# Altium schematic sheet RF.SchDoc
size A4
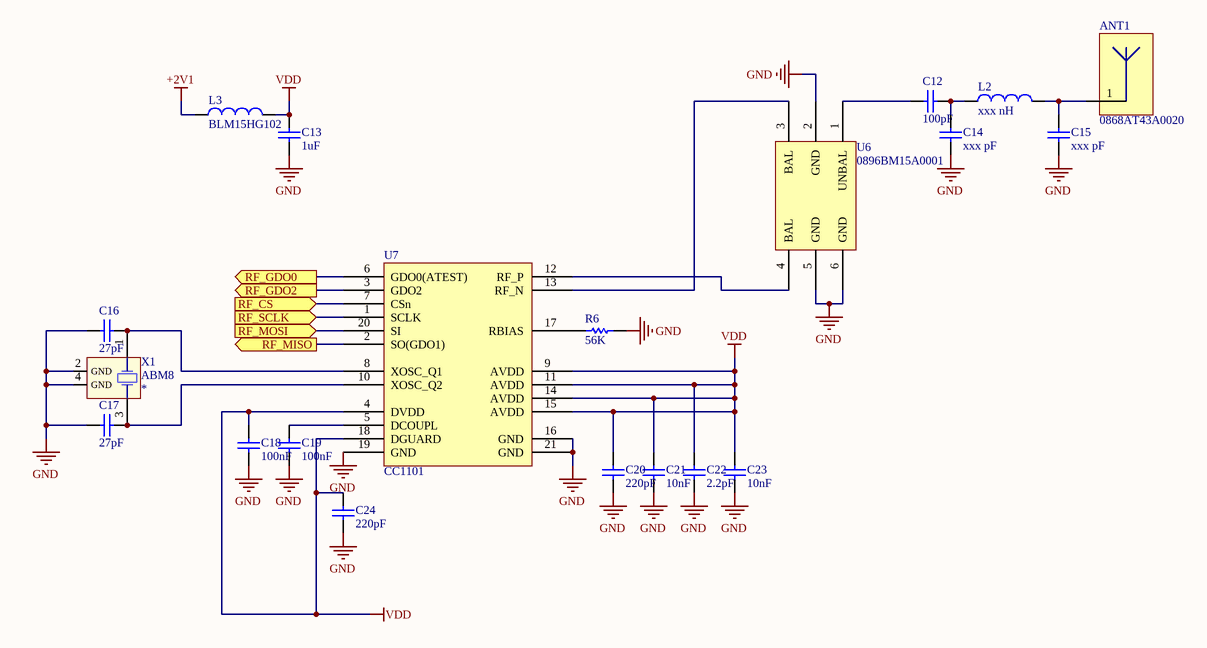
[diagram p0: RF.SchDoc]

## Parts
ANT1  0868AT43A0020  [0868AT43A0020]
C12  value 100pF  [0402_ipc]  (hidden comment: Cap)
C13  value 1uF  [0402_ipc]  (hidden comment: Cap)
C14  value xxx pF  [0402_ipc]  (hidden comment: Cap)
C15  value xxx pF  [0402_ipc]  (hidden comment: Cap)
C16  value 27pF  [0402_ipc]  (hidden comment: Cap)
C17  value 27pF  [0402_ipc]  (hidden comment: Cap)
C18  value 100nF  [0402_ipc]  (hidden comment: Cap)
C19  value 100nF  [0402_ipc]  (hidden comment: Cap)
C20  value 220pF  [0402_ipc]  (hidden comment: Cap)
C21  value 10nF  [0402_ipc]  (hidden comment: Cap)
C22  value 2.2pF  [0402_ipc]  (hidden comment: Cap)
C23  value 10nF  [0402_ipc]  (hidden comment: Cap)
C24  value 220pF  [0402_ipc]  (hidden comment: Cap)
L2  value xxx nH  [0402_ipc]  (hidden comment: Inductor)
L3  value BLM15HG102  [0603_ipc]  (hidden comment: Inductor)
R6  value 56K  [0402_ipc]  (hidden comment: Res)
U6  0896BM15A0001  [0896BM15A0001]
U7  CC1101  [CC1101_QFN]
X1  ABM8  [ABM8]

## Ports
RF_CS (in), RF_GDO0 (out), RF_GDO2 (out), RF_MISO (out), RF_MOSI (in), RF_SCLK (in)

## Nets
+2V1: L3.1
GND: C13.1 C14.2 C15.2 C16.2 C17.2 C18.2 C19.2 C20.1 C21.1 C22.1 C23.1 C24.1 R6.2 U6.2(GND) U6.5(GND) U6.6(GND) U7.16(GND) U7.19(GND) U7.21(GND) X1.2(GND) X1.4(GND)
VDD: C13.2 C18.1 C20.2 C21.2 C22.2 C23.2 C24.2 L3.2 U7.4(DVDD) U7.9(AVDD) U7.11(AVDD) U7.14(AVDD) U7.15(AVDD) U7.18(DGUARD)
RF_CS: U7.7(CSn) ; port RF_CS
RF_GDO0: U7.6(GDO0(ATEST)) ; port RF_GDO0
RF_GDO2: U7.3(GDO2) ; port RF_GDO2
RF_MISO: U7.2(SO(GDO1)) ; port RF_MISO
RF_MOSI: U7.20(SI) ; port RF_MOSI
RF_SCLK: U7.1(SCLK) ; port RF_SCLK
NetANT1_1: ANT1.1(RF) C15.1 L2.2
NetC12_1: C12.1 C14.1 L2.1
NetC12_2: C12.2 U6.1(UNBAL)
NetC16_1: C16.1 U7.8(XOSC_Q1) X1.1(OSC1)
NetC17_1: C17.1 U7.10(XOSC_Q2) X1.3(OSC2)
NetC19_1: C19.1 U7.5(DCOUPL)
NetR6_1: R6.1 U7.17(RBIAS)
NetU6_3: U6.3(BAL) U7.13(RF_N)
NetU6_4: U6.4(BAL) U7.12(RF_P)

## Library data of the parts
ANT1 = 0868AT43A0020: 868 MHz Chip Ceramic Antenna; PartNumber: 0868AT43A0020E; Farnell: 1885493
C12 = Cap: Capacitor; PartNumber: GRM1555C1H101JA01D; PackageReference: RAD-0.3; Publisher: Altium Limited; Farnell: 2218836
C13 = Cap: Capacitor; PartNumber: GRM155R61C105KA12D; PackageReference: RAD-0.3; Publisher: Altium Limited; Farnell: 2362093
C14 C15 = Cap: Capacitor; PackageReference: RAD-0.3; Publisher: Altium Limited
C16 C17 = Cap: Capacitor; PartNumber: GRM1555C1H270JA01D; PackageReference: RAD-0.3; Publisher: Altium Limited; Farnell: 1828877
C18 C19 = Cap: Capacitor; PartNumber: GRM155R71C104KA88D; PackageReference: RAD-0.3; Publisher: Altium Limited; Farnell: 8819742
C20 C24 = Cap: Capacitor; PartNumber: GCM1555C1H221JA16D; PackageReference: RAD-0.3; Publisher: Altium Limited; Farnell: 2494185
C21 C23 = Cap: Capacitor; PartNumber: GRM155R71C103KA01D; PackageReference: RAD-0.3; Publisher: Altium Limited; Farnell: 1828864
C22 = Cap: Capacitor; PartNumber: GRM1555C1H2R2CA01D; PackageReference: RAD-0.3; Publisher: Altium Limited; Farnell: 2434609
L3 = Inductor: PartNumber: BLM15HG102SN1D; Farnell: 1515788
R6 = Res: Resistor; PartNumber: ERJ2RKF5602X; Farnell: 2302814
U6 = 0896BM15A0001: Balun integrated matching for CC1101 868-915MHz; PartNumber: 0896BM15A0001E; Farnell: 1885513
U7 = CC1101: PartNumber: CC1101RGPR; Farnell: 2422921
X1 = ABM8: Quartz 32 MHz; PartNumber: ABM8-26.000MHZ-10-1-U-T; Reference: *; Farnell: 2467834